# EAGLE schematic PropGame_DevBoard_schema (EAGLE 6.3)
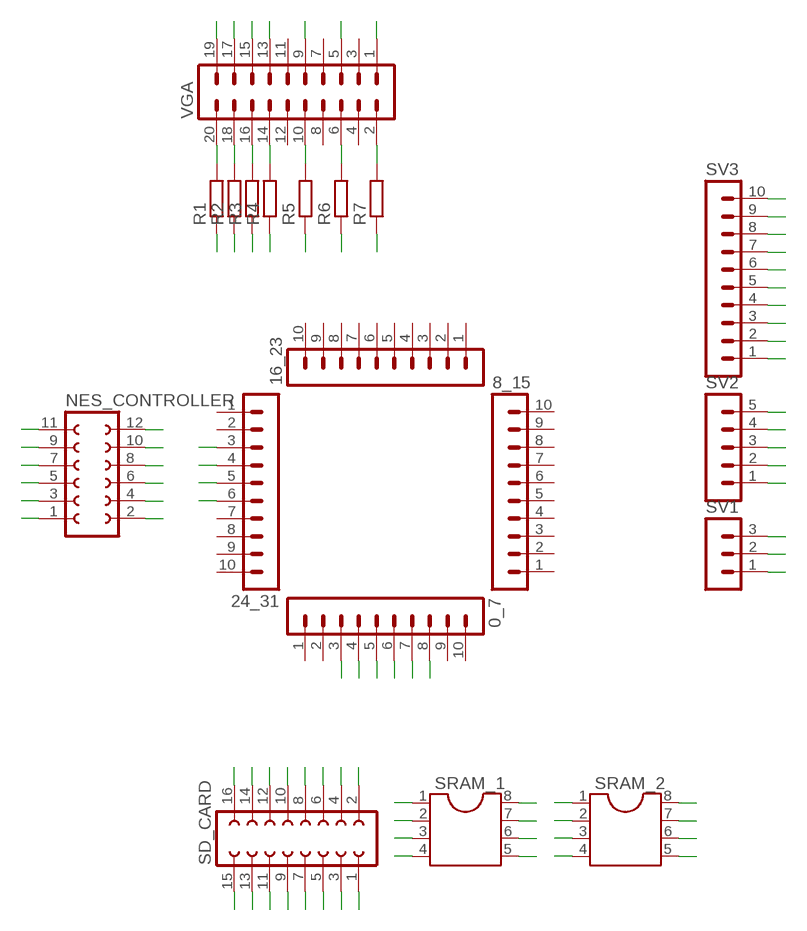
[diagram p0: schematic, sheet 1]

## Parts
0_7  MA10-1  [MA10-1]
8_15  MA10-1  [MA10-1]
16_23  MA10-1  [MA10-1]
24_31  MA10-1  [MA10-1]
NES_CONTROLLER  FE06-2  [FE06-2]
R1  R-EU_0204/7  [0204/7]
R2  R-EU_0204/7  [0204/7]
R3  R-EU_0204/7  [0204/7]
R4  R-EU_0204/7  [0204/7]
R5  R-EU_0204/7  [0204/7]
R6  R-EU_0204/7  [0204/7]
R7  R-EU_0204/7  [0204/7]
SD_CARD  FE08-2  [FE08-2]
SRAM_1  DIL8  [DIL08]
SRAM_2  DIL8  [DIL08]
SV1  MA03-1  [MA03-1]
SV2  MA05-1  [MA05-1]
SV3  MA10-1  [MA10-1]
VGA  MA10-2  [MA10-2]

## Nets
3V3: SD_CARD.13 SD_CARD.14 SRAM_1.8 SRAM_2.8 SV1.1 SV1.2 SV1.3
5V: NES_CONTROLLER.3 NES_CONTROLLER.4 SD_CARD.11 SD_CARD.12 SV3.1 SV3.2 SV3.3
CLK: 24_31.3 NES_CONTROLLER.11 NES_CONTROLLER.12
CS_1: 0_7.6 SD_CARD.9 SD_CARD.10
CS_2: 0_7.7 SRAM_1.1
CS_3: 0_7.8 SRAM_2.1
DATA1: 24_31.5 NES_CONTROLLER.7 NES_CONTROLLER.8
DATA2: 24_31.6 NES_CONTROLLER.5 NES_CONTROLLER.6
GND: NES_CONTROLLER.1 NES_CONTROLLER.2 SD_CARD.1 SD_CARD.2 SD_CARD.15 SD_CARD.16 SRAM_1.4 SRAM_2.4 SV2.1 SV2.2 SV2.3 SV2.4 SV2.5 SV3.4 SV3.5 SV3.6 SV3.7 SV3.8 SV3.9 SV3.10
LATCH: 24_31.4 NES_CONTROLLER.9 NES_CONTROLLER.10
MISO: 0_7.5 SD_CARD.3 SD_CARD.4 SRAM_1.2 SRAM_2.2
MOSI: 0_7.4 SD_CARD.7 SD_CARD.8 SRAM_1.5 SRAM_2.5
N$1: R1.2 VGA.20
N$2: R2.2 VGA.18
N$3: R3.2 VGA.16
N$4: R4.2 VGA.14
N$5: R5.2 VGA.10
N$6: R6.2 VGA.6
N$7: R7.2 VGA.2
N$15: SRAM_1.7
N$19: SRAM_2.3
N$21: SRAM_2.7
N$26: SRAM_1.3
SCK: 0_7.3 SD_CARD.5 SD_CARD.6 SRAM_1.6 SRAM_2.6
W_1: R1.1 VGA.19
W_2: R2.1 VGA.17
W_3: R3.1 VGA.15
W_4: R4.1 VGA.13
W_5: R5.1 VGA.9
W_6: R6.1 VGA.5
W_7: R7.1 VGA.1
Unconnected: 0_7.1 0_7.2 0_7.9 0_7.10 8_15.1 8_15.2 8_15.3 8_15.4 8_15.5 8_15.6 8_15.7 8_15.8 8_15.9 8_15.10 16_23.1 16_23.2 16_23.3 16_23.4 16_23.5 16_23.6 16_23.7 16_23.8 16_23.9 16_23.10 24_31.1 24_31.2 24_31.7 24_31.8 24_31.9 24_31.10 VGA.3 VGA.4 VGA.7 VGA.8 VGA.11 VGA.12

## Library data of the parts
0_7 8_15 16_23 24_31 SV3 = con-lstb:MA10-1: PIN HEADER; OC_FARNELL: unknown; OC_NEWARK: unknown
NES_CONTROLLER = con-lsta:FE06-2: FEMALE HEADER; OC_FARNELL: unknown; OC_NEWARK: unknown
R1-R7 = resistor:R-EU_: RESISTOR, European symbol
SD_CARD = con-lsta:FE08-2: FEMALE HEADER; OC_FARNELL: unknown; OC_NEWARK: unknown
SRAM_1 SRAM_2 = ic-package:DIL8: Dual In Line / Socket
SV1 = con-lstb:MA03-1: PIN HEADER; OC_FARNELL: unknown; OC_NEWARK: unknown
SV2 = con-lstb:MA05-1: PIN HEADER; OC_FARNELL: unknown; OC_NEWARK: unknown
VGA = con-lstb:MA10-2: PIN HEADER; OC_FARNELL: unknown; OC_NEWARK: unknown